# EAGLE schematic FT232-Breakout-Test (EAGLE 5.11)
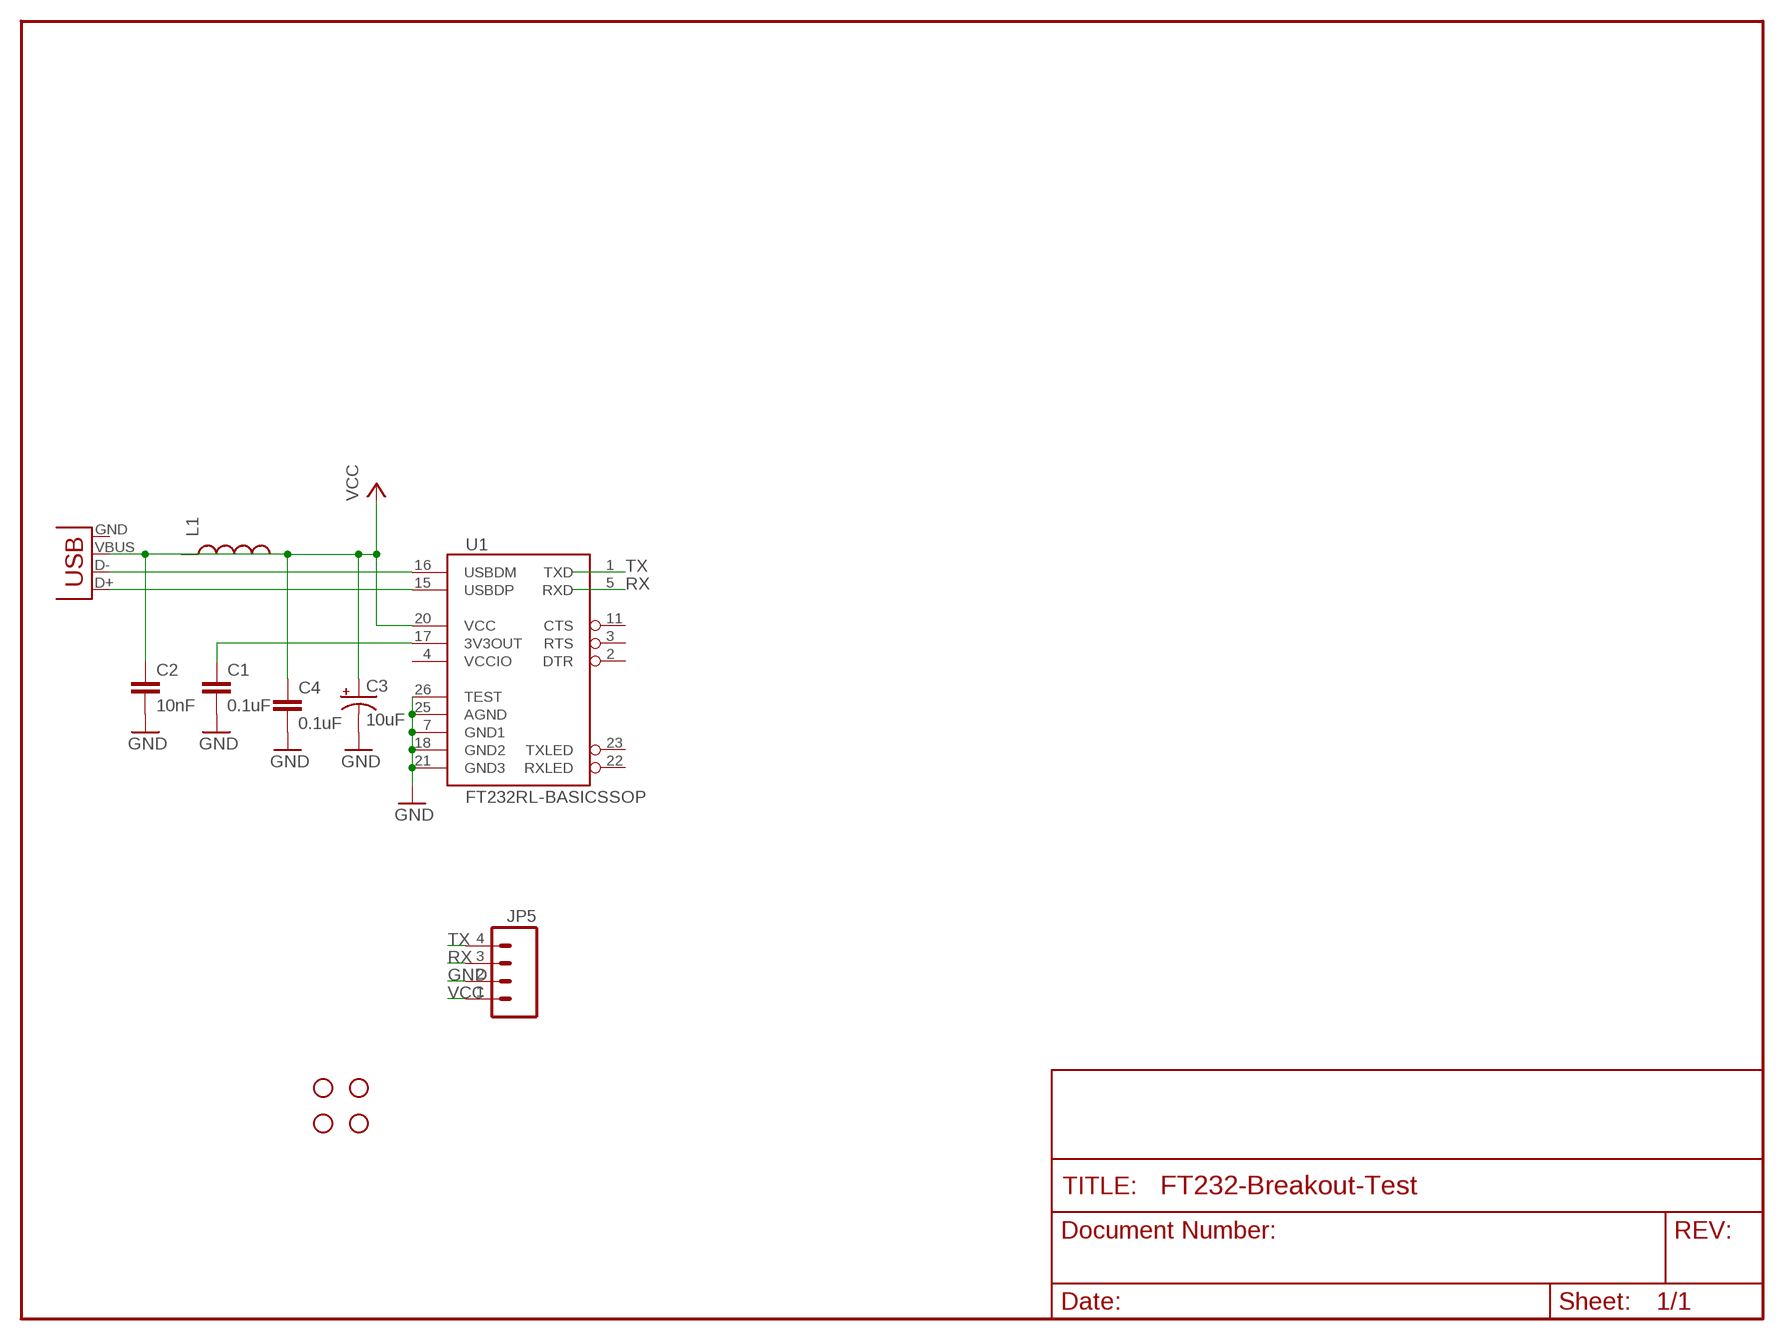
[diagram p0: schematic, sheet 1]

## Parts
C1  0.1uF  CAP0603-CAP  [0603-CAP]
C2  10nF  CAP0603-CAP  [0603-CAP]
C3  10uF  CAP_POL1206  [EIA3216]
C4  0.1uF  CAP0603-CAP  [0603-CAP]
JP1  STAND-OFF  [STAND-OFF]
JP2  STAND-OFF  [STAND-OFF]
JP3  STAND-OFF  [STAND-OFF]
JP4  STAND-OFF  [STAND-OFF]
JP5  M04PTH  [1X04]
L1  INDUCTOR0603  [0603]
U1  FT232RL-BASICSSOP  [SSOP28DB]
X2  USBPTH  [USB-B-PTH]

## Nets
GND: C1.2 C2.2 C3.C(-) C4.2 JP5.2 U1.7(GND1) U1.18(GND2) U1.21(GND3) U1.25(AGND) U1.26(TEST)
N$1: U1.15(USBDP) X2.D+
N$2: C1.1 U1.17(3V3OUT)
N$5: U1.16(USBDM) X2.D-
RX: JP5.3 U1.5(RXD)
TX: JP5.4 U1.1(TXD)
VCC: C2.1 C3.A(+) C4.1 JP5.1 L1.2 U1.20(VCC) X2.VBUS
Unconnected: L1.1 U1.2(DTR) U1.3(RTS) U1.11(CTS) U1.22(RXLED) U1.23(TXLED) X2.GND

## Power pins joined to a net without a drawn wire
VCCIO: U1.4(VCCIO)

## Library data of the parts
C1 C2 C4 = SparkFun:CAP: Capacitor Standard 0603 ceramic capacitor, and 0.1" leaded capacitor.
C3 = SparkFun:CAP_POL: Capacitor Polarized These are standard SMD and PTH capacitors. Normally 10uF, 47uF, and 100uF in electrolytic and tantalum varieties. Always verify the external diameter of the through hole cap, it varies with capacity, voltage, and manufacturer. The EIA devices should be standard.
JP1-JP4 = SparkFun:STAND-OFF: Stand Off This is the mechanical footprint for a #4 phillips button head screw. Use the keepout ring to avoid running the screw head into surrounding components. SKU : PRT-00447
JP5 = SparkFun:M04: Header 4 Standard 4-pin 0.1" header. Use with straight break away headers (SKU : PRT-00116), right angle break away headers (PRT-00553), swiss pins (PRT-00743), machine pins (PRT-00117), and female headers (PRT-00115). Molex polarized connector foot print use with SKU : PRT-08231 with associated crimp pins and housings. 1MM SMD Version SKU: PRT-10208
L1 = SparkFun:INDUCTOR: Inductors Basic Inductor/Choke - 0603 and 1206. Footprints are not proven and vary greatly between part numbers.
U1 = SparkFun:FT232RL-BASIC: USB UART This is the simplified version of the FT232RL unit. Only what you need, nothing you don't. Spark Fun Electronics SKU : COM-00650
X2 = SparkFun:USB: USB Connectors USB-B-PTH is fully proven SKU : PRT-00139 USB-miniB is fully proven SKU : PRT-00587 USB-A-PCB is untested. USB-A-H is throughly reviewed, but untested. Spark Fun Electronics SKU : PRT-00437 USB-B-SMT is throughly reviewed, but untested. Needs silkscreen touching up. USB-A-S has not been used/tested USB-MB-H has not been used/tested